# EasyEDA schematic SCH_ArgonLockModuleV2_2022-05-29.json
TITLE: SIT210 Embedded Systems Smart Lock System; REV: 1.0; Date: 2022-05-23; Sheet: 1/1; Drawn By: MichaelDawson; Company: Deakin University
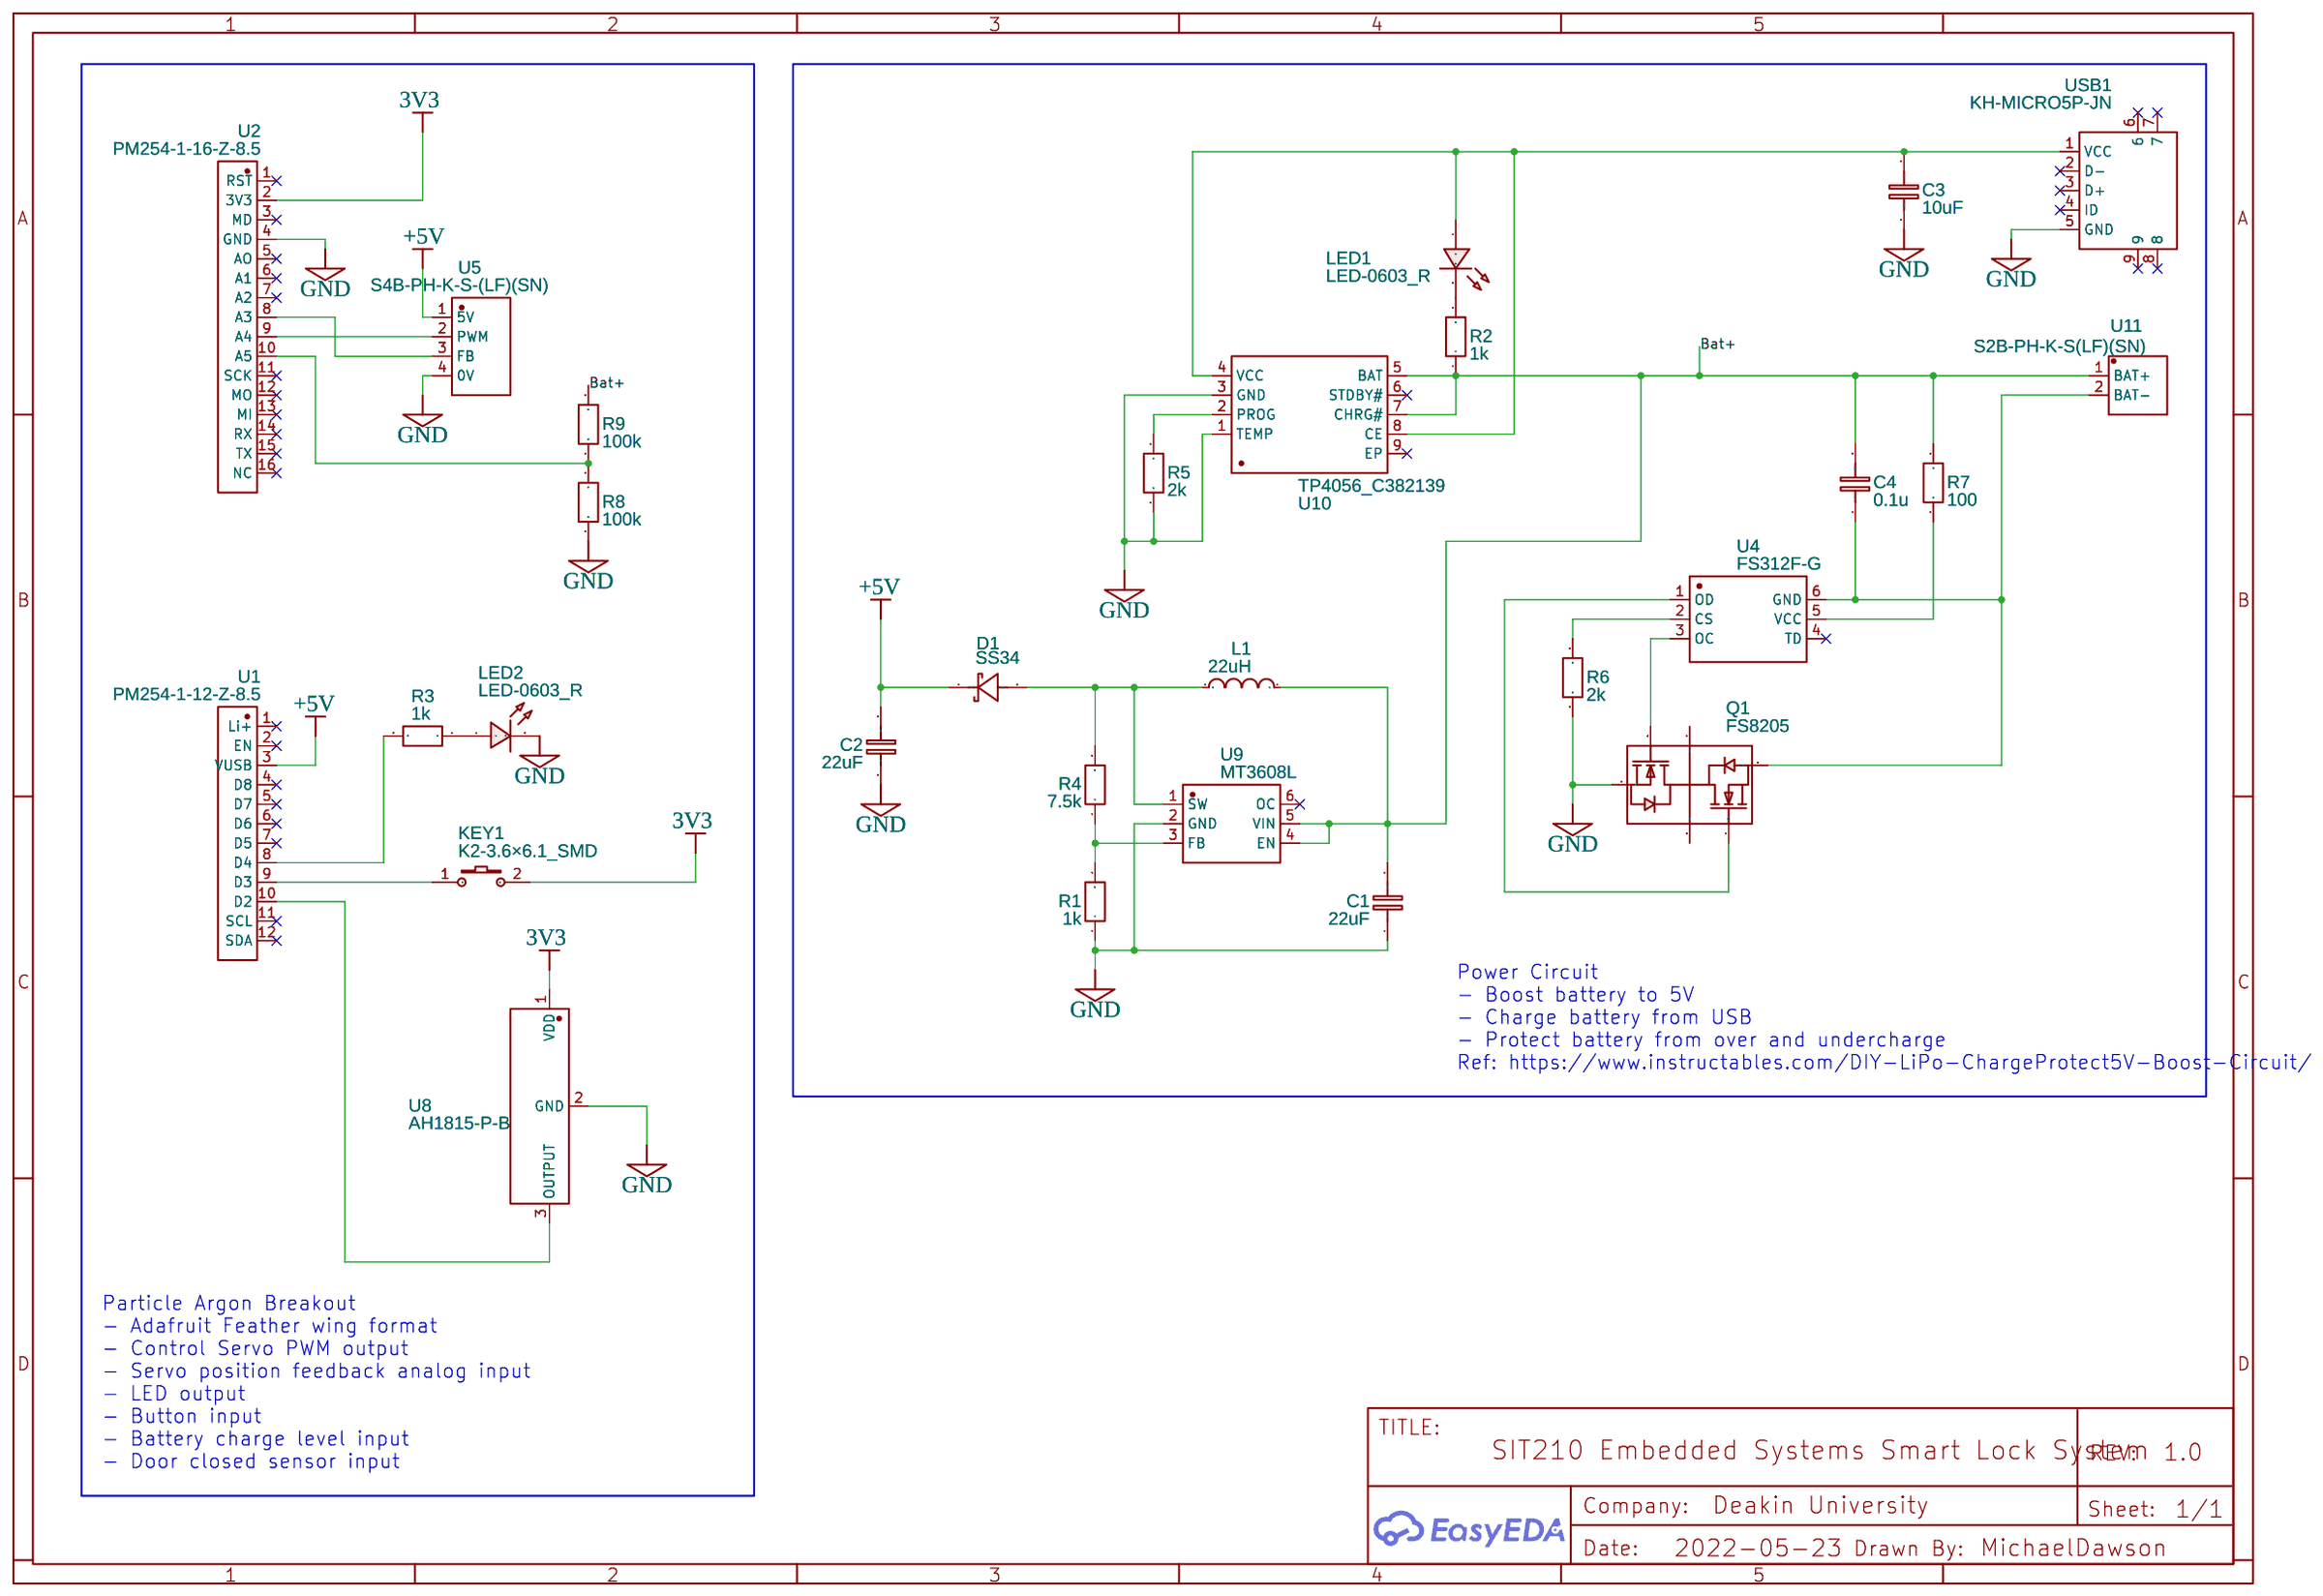
[diagram p0: schematic sheet]

## Parts
C1  22uF  [C0603]
C2  22uF  [C0603]
C3  10uF  [C0603]
C4  0.1u  [C0603]
D1  SS34  [SMA_L4.3-W2.7-LS5.1-RD]
KEY1  K2-3.6×6.1_SMD  [KEY-SMD_2P-L6.2-W3.6-LS8.0]
L1  22uH  [IND-SMD_L11.5-W11.0]
LED1  LED-0603_R  [LED0603_RED]
LED2  LED-0603_R  [LED0603_RED]
Q1  FS8205  [SOT-23-6_L2.9-W1.6-P0.95-LS2.8-BR]
R1  1k  [R0603]
R2  1k  [R0603]
R3  1k  [R0603]
R4  7.5k  [R0603]
R5  2k  [R0603]
R6  2k  [R0603]
R7  100  [R0603]
R8  100k  [R0603]
R9  100k  [R0603]
U1  PM254-1-12-Z-8.5  [HDR-TH_12P-P2.54-V-F]
U2  PM254-1-16-Z-8.5  [HDR-TH_16P-P2.54-V-F-A]
U4  FS312F-G  [SOT-23-6_L2.9-W1.6-P0.95-LS2.8-BR]
U5  S4B-PH-K-S-(LF)(SN)  [CONN-TH_4P-P2.00_S4B-PH-K-S-LF-SN]
U8  AH1815-P-B  [TO-92S_3P-L4.1-W1.6-P1.27-L]
U9  MT3608L  [SOT-23-6_L2.9-W1.7-P0.95-LS2.8-BL]
U10  TP4056_C382139  [ESOP-8_L4.9-W3.9-P1.27-LS6.0-BL-EP]
U11  S2B-PH-K-S(LF)(SN)  [CONN-TH_S2B-PH-K-S-LF-SN]
USB1  KH-MICRO5P-JN  [MICRO-USB-SMD_KH-MICRO5P-JN]

## Library data of the parts
C1-C4 = C_0603_EU: Contributor: LCEDA_Lib
D1 = SS34_C908680: Supplier: LCSC; Supplier Part: C908680; Manufacturer: GOODWORK(固得沃克); Contributor: LCSC; JLCPCB Part Class: Extended Part
KEY1 = K2-3.6×6.1_SMD: Supplier Part: C118141; Supplier: LCSC; Manufacturer Part: K2-1107ST-A4SW-06; Contributor: LCEDA_Lib; 制造商: 韩国韩荣
L1 = MAPM1040F-220M-LF: Supplier: LCSC; Supplier Part: C280934; Manufacturer: microgate; Contributor: LCSC
LED1 LED2 = LED-0603_R: Manufacturer: EVERLIGHT(台湾亿光); Manufacturer Part: 19-217/R6C-AL1M2VY/3T; Supplier Part: C72044; Supplier: LCSC; Contributor: LCEDA_01
Q1 = FS8205: Supplier: LCSC; Manufacturer: FORTUNE; Supplier Part: C32254; JLCPCB Part Class: Extended Part
R1-R9 = R_0603_EU: Contributor: LCEDA_Lib
U1 = PM254-1-12-Z-8.5: Supplier: LCSC; Supplier Part: C2897375; Manufacturer: HCTL(华灿天禄); Contributor: LCSC; JLCPCB Part Class: Extended Part
U2 = PM254-1-16-Z-8.5: Supplier: LCSC; Supplier Part: C2897379; Manufacturer: HCTL(华灿天禄); Contributor: LCSC; JLCPCB Part Class: Extended Part
U4 = FS312F-G: Supplier: LCSC; Manufacturer: FORTUNE; Supplier Part: C82736; JLCPCB Part Class: Extended Part
U5 = S4B-PH-K-S-(LF)(SN): Supplier: LCSC; Supplier Part: C157926; Manufacturer: JST Sales America; Contributor: LCSC; JLCPCB Part Class: Extended Part
U8 = AH1815-P-B: Supplier: LCSC; Manufacturer: DIODES; Contributor: LCSC; Supplier Part: C151373; JLCPCB Part Class: Extended Part
U9 = MT3608L: Supplier: LCSC; Supplier Part: C2932326; Manufacturer: 西安航天民芯; Contributor: LCSC; JLCPCB Part Class: Extended Part
U10 = TP4056_C382139: Supplier: LCSC; Supplier Part: C382139; Manufacturer: TPOWER; Manufacturer Part: TP4056; Contributor: LCSC; JLCPCB Part Class: Extended Part
U11 = S2B-PH-K-S(LF)(SN): Supplier: LCSC; Supplier Part: C173752; Manufacturer: JST Sales America; Contributor: LCSC; JLCPCB Part Class: Extended Part
USB1 = KH-MICRO5P-JN: Supplier: LCSC; Supplier Part: C962222; Manufacturer: Shenzhen Kinghelm Elec; Contributor: LCSC; JLCPCB Part Class: Extended Part

## Nets
3V3: KEY1.2 U2.2(3V3) U8.1(VDD)
+5V: C2.2 D1.1(C) U1.3(VUSB) U5.1(5V)
GND: C1.1 C2.1 C3.1 LED2.2 Q1.1(S1) R1.1 R5.2 R6.1 R8.1 U2.4(GND) U5.4(0V) U8.2(GND) U9.2(GND) U10.1(TEMP) U10.3(GND) USB1.5(GND)
Bat+: C1.2 C4.2 L1.1 R2.1 R7.2 R9.2 U9.4(EN) U9.5(VIN) U10.5(BAT) U10.7(CHRG#) U11.1(BAT+)
Net-(C3-2): C3.2 LED1.1 U10.4(VCC) U10.8(CE) USB1.1(VCC)
Net-(C4-1): C4.1 Q1.3(S2) U4.6(GND) U11.2(BAT-)
Net-(D1-2): D1.2(A) L1.2 R4.2 U9.1(SW)
Net-(KEY1-1): KEY1.1 U1.9(D3)
Net-(LED1-2): LED1.2 R2.2
Net-(LED2-1): LED2.1 R3.1
Net-(Q1-4): Q1.4(G2) U4.1(OD)
Net-(Q1-6): Q1.6(G1) U4.3(OC)
Net-(R1-2): R1.2 R4.1 U9.3(FB)
Net-(R3-2): R3.2 U1.8(D4)
Net-(R5-1): R5.1 U10.2(PROG)
Net-(R6-2): R6.2 U4.2(CS)
Net-(R7-1): R7.1 U4.5(VCC)
Net-(R8-2): R8.2 R9.1 U2.10(A5)
Net-(U1-10): U1.10(D2) U8.3(OUTPUT)
Net-(U2-8): U2.8(A3) U5.3(FB)
Net-(U2-9): U2.9(A4) U5.2(PWM)

Not connected (* = marked no-connect by the designer): Q1 2(D12) 5(D12); U1 1(Li+)* 2(EN)* 4(D8)* 5(D7)* 6(D6)* 7(D5)* 11(SCL)* 12(SDA)*; U2 1(RST)* 3(MD)* 5(AO)* 6(A1)* 7(A2)* 11(SCK)* 12(MO)* 13(MI)* 14(RX)* 15(TX)* 16(NC)*; U4 4(TD)*; U9 6(OC)*; U10 6(STDBY#)* 9(EP)*; USB1 2(D-)* 3(D+)* 4(ID)* 6* 7* 8* 9*

## Notes on the sheet
- Power Circuit
  - Boost battery to 5V
  - Charge battery from USB
  - Protect battery from over and undercharge
  Ref: https://www.instructables.com/DIY-LiPo-ChargeProtect5V-Boost-Circuit/
- Particle Argon Breakout
  - Adafruit Feather wing format
  - Control Servo PWM output
  - Servo position feedback analog input
  - LED output
  - Button input
  - Battery charge level input
  - Door closed sensor input
